# EAGLE design Uniformity Array (EAGLE 7.5.0)
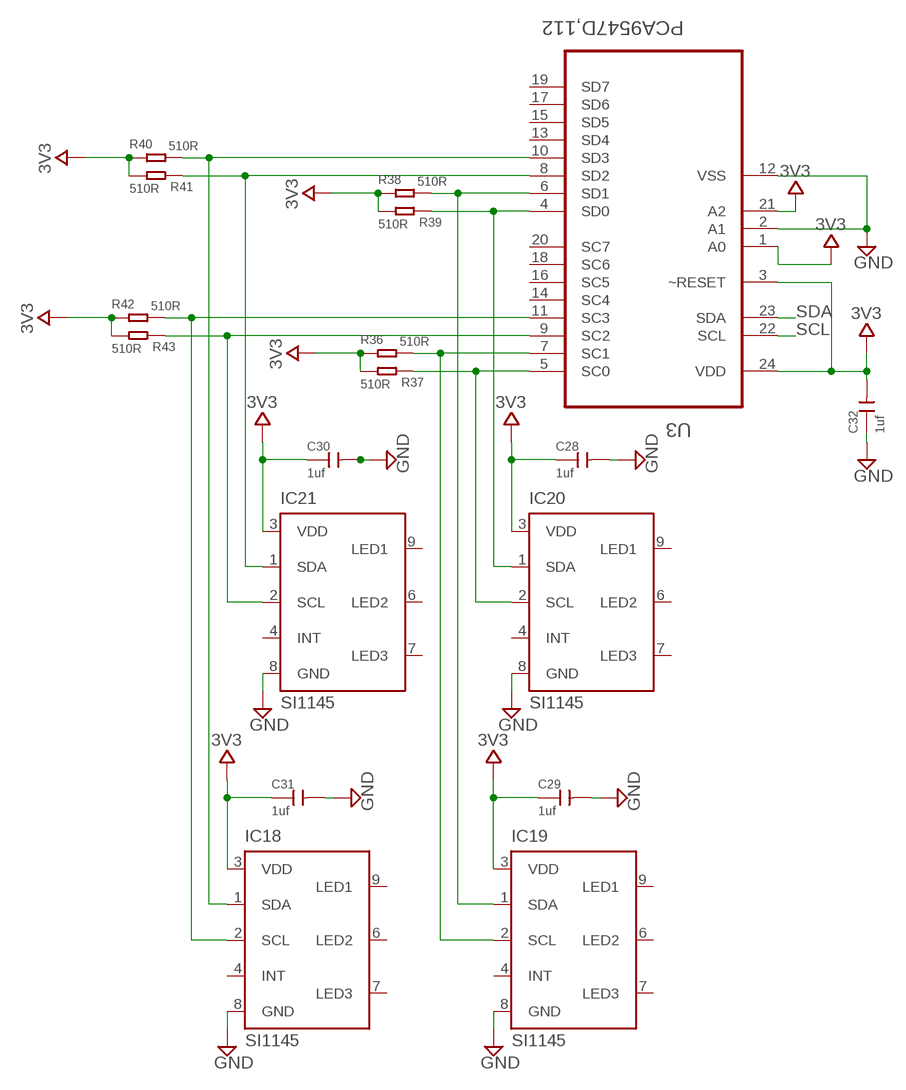
[diagram p0: schematic, sheet 1, part 1 of 2]
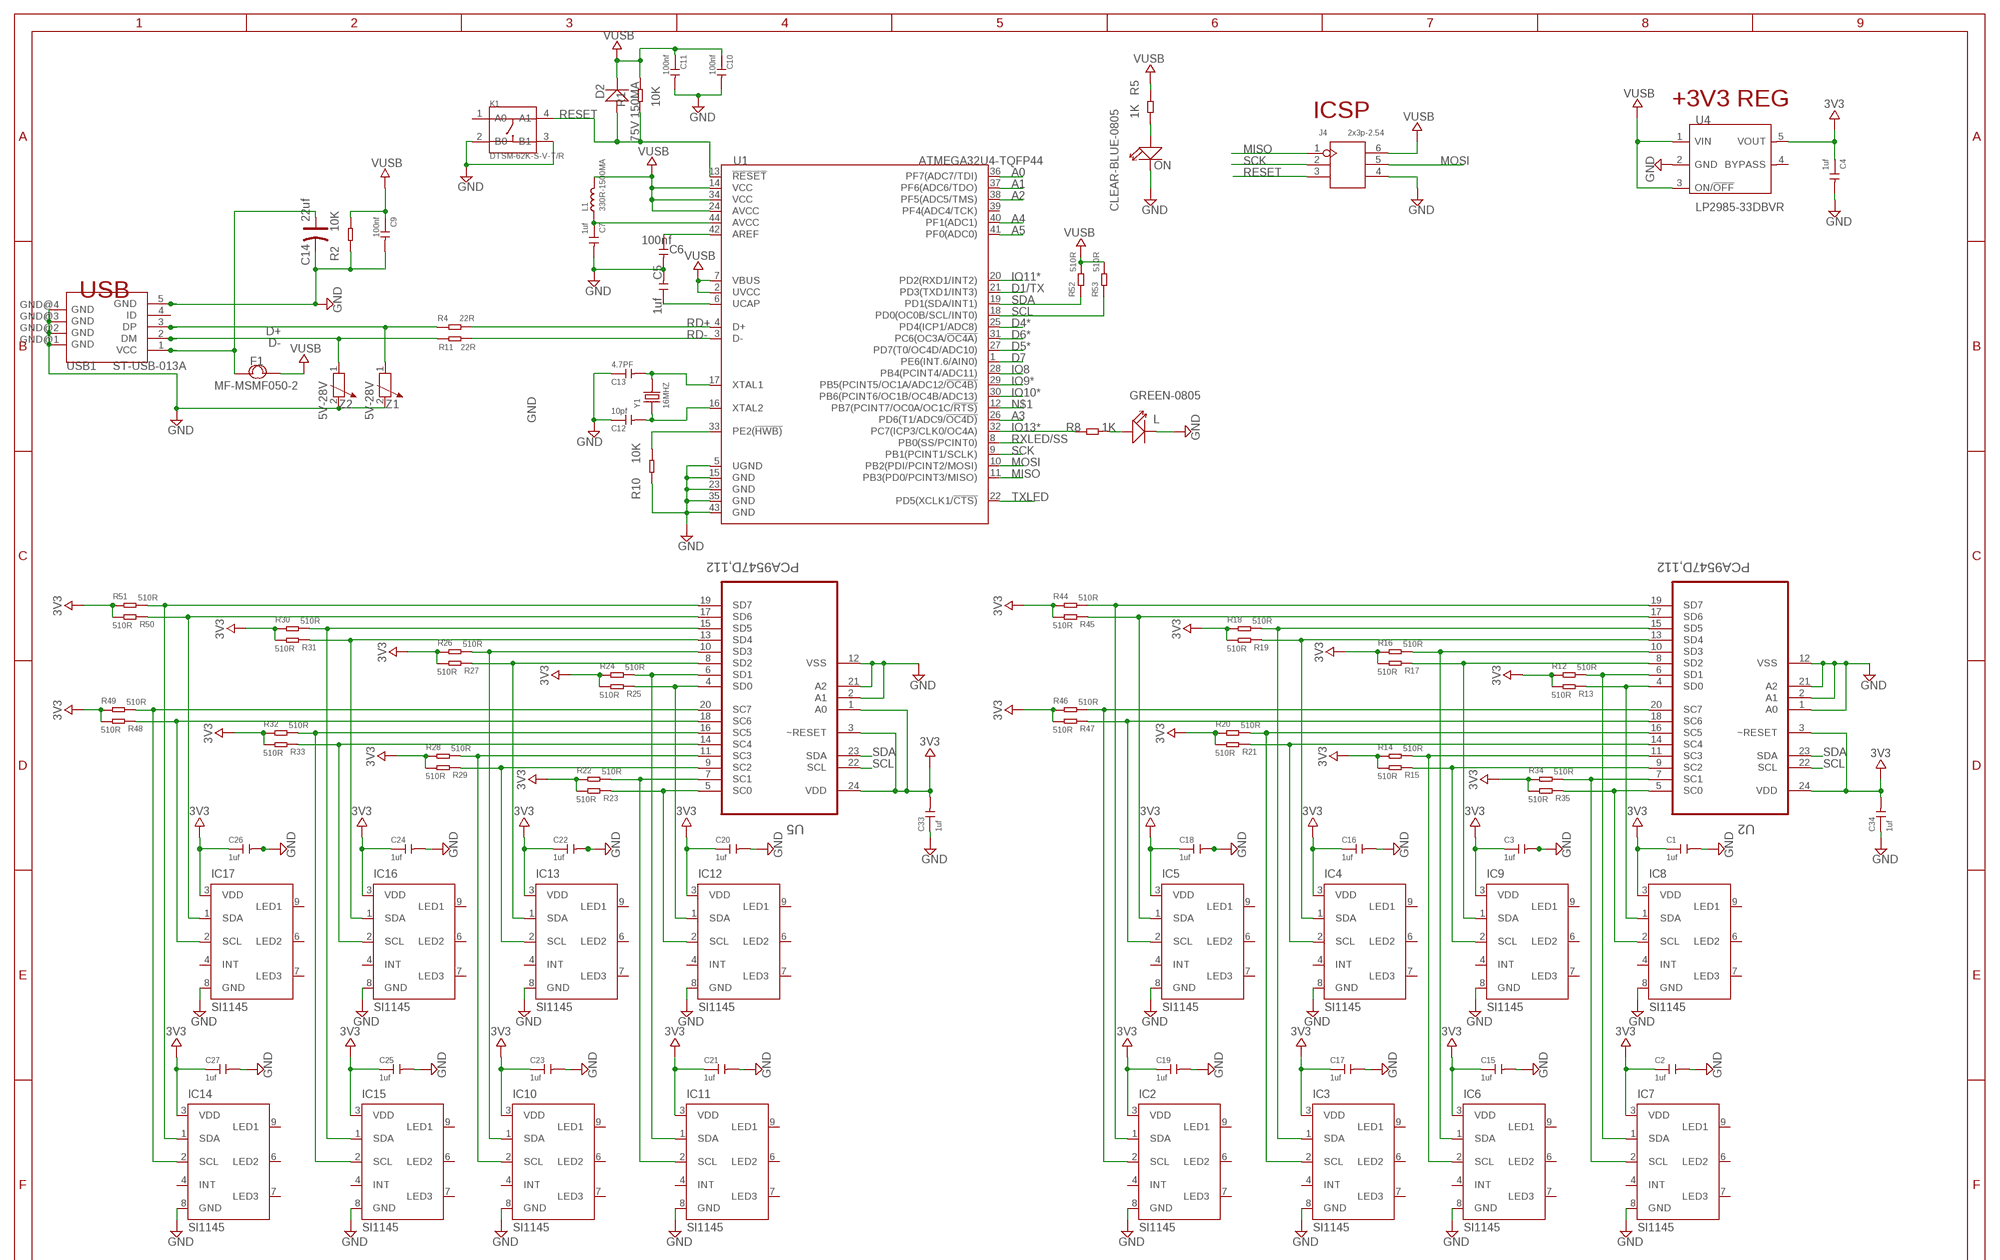
[diagram p1: schematic, sheet 1, part 2 of 2]

## Parts
C1  1uf  CERAMIC-1UF-10V-10%-X5R(0402)  [C0402]
C2  1uf  CERAMIC-1UF-10V-10%-X5R(0402)  [C0402]
C3  1uf  CERAMIC-1UF-10V-10%-X5R(0402)  [C0402]
C4  1uf  CERAMIC-1UF-10V-10%-X5R(0402)  [C0402]
C5  1uf  CERAMIC-1UF-10V-10%-X5R(0402)  [C0402]
C6  100nf  CERAMIC-100NF-25V-10%-X7R(0402)  [C0402]
C7  1uf  CERAMIC-1UF-10V-10%-X5R(0402)  [C0402]
C9  100nf  CERAMIC-100NF-25V-10%-X7R(0402)  [C0402]
C10  100nf  CERAMIC-100NF-25V-10%-X7R(0402)  [C0402]
C11  100nf  CERAMIC-100NF-25V-10%-X7R(0402)  [C0402]
C12  10pf  CERAMIC-10PF-50V-5%-NPO(0603)  [C0603]
C13  4.7PF  CERAMIC-4.7PF-50V-0.25PF-NPO(0603)  [C0603]
C14  22uf  TANTALUM-SMD-22UF-10V(AVX-A)  [AVX-A]
C15  1uf  CERAMIC-1UF-10V-10%-X5R(0402)  [C0402]
C16  1uf  CERAMIC-1UF-10V-10%-X5R(0402)  [C0402]
C17  1uf  CERAMIC-1UF-10V-10%-X5R(0402)  [C0402]
C18  1uf  CERAMIC-1UF-10V-10%-X5R(0402)  [C0402]
C19  1uf  CERAMIC-1UF-10V-10%-X5R(0402)  [C0402]
C20  1uf  CERAMIC-1UF-10V-10%-X5R(0402)  [C0402]
C21  1uf  CERAMIC-1UF-10V-10%-X5R(0402)  [C0402]
C22  1uf  CERAMIC-1UF-10V-10%-X5R(0402)  [C0402]
C23  1uf  CERAMIC-1UF-10V-10%-X5R(0402)  [C0402]
C24  1uf  CERAMIC-1UF-10V-10%-X5R(0402)  [C0402]
C25  1uf  CERAMIC-1UF-10V-10%-X5R(0402)  [C0402]
C26  1uf  CERAMIC-1UF-10V-10%-X5R(0402)  [C0402]
C27  1uf  CERAMIC-1UF-10V-10%-X5R(0402)  [C0402]
C28  1uf  CERAMIC-1UF-10V-10%-X5R(0402)  [C0402]
C29  1uf  CERAMIC-1UF-10V-10%-X5R(0402)  [C0402]
C30  1uf  CERAMIC-1UF-10V-10%-X5R(0402)  [C0402]
C31  1uf  CERAMIC-1UF-10V-10%-X5R(0402)  [C0402]
C32  1uf  CERAMIC-1UF-10V-10%-X5R(0402)  [C0402]
C33  1uf  CERAMIC-1UF-10V-10%-X5R(0402)  [C0402]
C34  1uf  CERAMIC-1UF-10V-10%-X5R(0402)  [C0402]
D2  75V 150MA  SMD-DIODE-SWITCHING-75V-150MA(D1206)  [LED-1206]
F1  MF-MSMF050-2  SMD-PPTC-USE-PPTC-0.50A-15V-0.15OHM(1812)  [F1812]
IC2  SI1145  [QFN-10]
IC3  SI1145  [QFN-10]
IC4  SI1145  [QFN-10]
IC5  SI1145  [QFN-10]
IC6  SI1145  [QFN-10]
IC7  SI1145  [QFN-10]
IC8  SI1145  [QFN-10]
IC9  SI1145  [QFN-10]
IC10  SI1145  [QFN-10]
IC11  SI1145  [QFN-10]
IC12  SI1145  [QFN-10]
IC13  SI1145  [QFN-10]
IC14  SI1145  [QFN-10]
IC15  SI1145  [QFN-10]
IC16  SI1145  [QFN-10]
IC17  SI1145  [QFN-10]
IC18  SI1145  [QFN-10]
IC19  SI1145  [QFN-10]
IC20  SI1145  [QFN-10]
IC21  SI1145  [QFN-10]
J4  2x3p-2.54  DIP-BLACK-MALE-HEADER(2X3P-2.54）-2.54  [H2X3-2.54]
K1  DTSM-62K-S-V-T/R  SMD-SWITCH-TACTILE-SPST-NO(4P-D6.0MM)  [SW4-SMD-6.0X6.0X5.0MM]
L  GREEN-0805  SMD-LED-CLEAR-GREEN(0805)  [LED-0805]
L1  330R-1500MA  SMD-FERRITE-BEAD-330R-1500MA(0805)'0805'  [L0805]
ON  CLEAR-BLUE-0805  SMD-LED-CLEAR-BLUE(0805)  [LED-0805]
R1  10K  SMD-RES-10K-5%-1/(0402)  [R0402]
R2  10K  SMD-RES-10K-5%-1/(0402)  [R0402]
R4  22R  SMD-RES-22R-5%-1/10W(0603)  [R0603]
R5  1K  SMD-RES-1K-5%-1/16W(0402)  [R0402]
R8  1K  SMD-RES-1K-5%-1/16W(0402)  [R0402]
R10  10K  SMD-RES-10K-5%-1/(0402)  [R0402]
R11  22R  SMD-RES-22R-5%-1/10W(0603)  [R0603]
R12  510R  SMD-RES-510R-5%-1/10W(0603)  [R0603]
R13  510R  SMD-RES-510R-5%-1/10W(0603)  [R0603]
R14  510R  SMD-RES-510R-5%-1/10W(0603)  [R0603]
R15  510R  SMD-RES-510R-5%-1/10W(0603)  [R0603]
R16  510R  SMD-RES-510R-5%-1/10W(0603)  [R0603]
R17  510R  SMD-RES-510R-5%-1/10W(0603)  [R0603]
R18  510R  SMD-RES-510R-5%-1/10W(0603)  [R0603]
R19  510R  SMD-RES-510R-5%-1/10W(0603)  [R0603]
R20  510R  SMD-RES-510R-5%-1/10W(0603)  [R0603]
R21  510R  SMD-RES-510R-5%-1/10W(0603)  [R0603]
R22  510R  SMD-RES-510R-5%-1/10W(0603)  [R0603]
R23  510R  SMD-RES-510R-5%-1/10W(0603)  [R0603]
R24  510R  SMD-RES-510R-5%-1/10W(0603)  [R0603]
R25  510R  SMD-RES-510R-5%-1/10W(0603)  [R0603]
R26  510R  SMD-RES-510R-5%-1/10W(0603)  [R0603]
R27  510R  SMD-RES-510R-5%-1/10W(0603)  [R0603]
R28  510R  SMD-RES-510R-5%-1/10W(0603)  [R0603]
R29  510R  SMD-RES-510R-5%-1/10W(0603)  [R0603]
R30  510R  SMD-RES-510R-5%-1/10W(0603)  [R0603]
R31  510R  SMD-RES-510R-5%-1/10W(0603)  [R0603]
R32  510R  SMD-RES-510R-5%-1/10W(0603)  [R0603]
R33  510R  SMD-RES-510R-5%-1/10W(0603)  [R0603]
R34  510R  SMD-RES-510R-5%-1/10W(0603)  [R0603]
R35  510R  SMD-RES-510R-5%-1/10W(0603)  [R0603]
R36  510R  SMD-RES-510R-5%-1/10W(0603)  [R0603]
R37  510R  SMD-RES-510R-5%-1/10W(0603)  [R0603]
R38  510R  SMD-RES-510R-5%-1/10W(0603)  [R0603]
R39  510R  SMD-RES-510R-5%-1/10W(0603)  [R0603]
R40  510R  SMD-RES-510R-5%-1/10W(0603)  [R0603]
R41  510R  SMD-RES-510R-5%-1/10W(0603)  [R0603]
R42  510R  SMD-RES-510R-5%-1/10W(0603)  [R0603]
R43  510R  SMD-RES-510R-5%-1/10W(0603)  [R0603]
R44  510R  SMD-RES-510R-5%-1/10W(0603)  [R0603]
R45  510R  SMD-RES-510R-5%-1/10W(0603)  [R0603]
R46  510R  SMD-RES-510R-5%-1/10W(0603)  [R0603]
R47  510R  SMD-RES-510R-5%-1/10W(0603)  [R0603]
R48  510R  SMD-RES-510R-5%-1/10W(0603)  [R0603]
R49  510R  SMD-RES-510R-5%-1/10W(0603)  [R0603]
R50  510R  SMD-RES-510R-5%-1/10W(0603)  [R0603]
R51  510R  SMD-RES-510R-5%-1/10W(0603)  [R0603]
R52  510R  SMD-RES-510R-5%-1/10W(0603)  [R0603]
R53  510R  SMD-RES-510R-5%-1/10W(0603)  [R0603]
U1  ATMEGA32U4-TQFP44  MCU-ATMEGA32U4(TQFP44)-AU  [TQFP44-0.8-9.6X9.6MM]
U2  PCA9547D,112  [SOIC127P1032X265-24N]
U3  PCA9547D,112  [SOIC127P1032X265-24N]
U4  LP2985-33DBVR  PMIC-LP2985-33DBVR(SOT23-5)  [SOT-23-5]
U5  PCA9547D,112  [SOIC127P1032X265-24N]
USB1  ST-USB-013A  MINI-USB2.0-RECEPT-5POS-4-LEGS-(ST-USB-013A)  [MINIUSB5+4P-0.8-90D]
Y1  16MHZ  SMD-CRYSTAL-16MHZ-8PF-20PPM-40R(2P-5.0X3.2MM)  [X2-SMD-5.0X3.2X1.3MM]
Z1  5V-28V  SMD-RES-VARISTOR-5V-28V(0603)  [R0603]
Z2  5V-28V  SMD-RES-VARISTOR-5V-28V(0603)  [R0603]

## Nets
3V3: C1.1 C2.1 C3.1 C4.1 C15.1 C16.1 C17.1 C18.1 C19.1 C20.1 C21.1 C22.1 C23.1 C24.1 C25.1 C26.1 C27.1 C28.1 C29.1 C30.1 C31.1 C32.2 C33.2 C34.2 IC2.3(VDD) IC3.3(VDD) IC4.3(VDD) IC5.3(VDD) IC6.3(VDD) IC7.3(VDD) IC8.3(VDD) IC9.3(VDD) IC10.3(VDD) IC11.3(VDD) IC12.3(VDD) IC13.3(VDD) IC14.3(VDD) IC15.3(VDD) IC16.3(VDD) IC17.3(VDD) IC18.3(VDD) IC19.3(VDD) IC20.3(VDD) IC21.3(VDD) R12.1 R13.1 R14.1 R15.1 R16.1 R17.1 R18.1 R19.1 R20.1 R21.1 R22.1 R23.1 R24.1 R25.1 R26.1 R27.1 R28.1 R29.1 R30.1 R31.1 R32.1 R33.1 R34.1 R35.1 R36.1 R37.1 R38.1 R39.1 R40.1 R41.1 R42.1 R43.1 R44.1 R45.1 R46.1 R47.1 R48.1 R49.1 R50.1 R51.1 U2.3(~RESET) U2.24(VDD) U3.1(A0) U3.3(~RESET) U3.21(A2) U3.24(VDD) U4.5(VOUT) U5.1(A0) U5.3(~RESET) U5.24(VDD)
A0: U1.36(PF7(ADC7/TDI))
A1: U1.37(PF6(ADC6/TDO))
A2: U1.38(PF5(ADC5/TMS))
A3: U1.26(PD6(T1/ADC9/!OC4D))
A4: U1.40(PF1(ADC1))
A5: U1.41(PF0(ADC0))
AREF: C6.1 U1.42(AREF)
AVCC: C7.1 L1.1 U1.44(AVCC)
D1/TX: U1.21(PD3(TXD1/INT3))
D4*: U1.25(PD4(ICP1/ADC8))
D5*: U1.31(PC6(OC3A/!OC4A))
D6*: U1.27(PD7(T0/OC4D/ADC10))
D7: U1.1(PE6(INT.6/AIN0))
D+: R4.1 USB1.3(DP) Z1.1
D-: R11.1 USB1.2(DM) Z2.1
GND: C1.2 C2.2 C3.2 C4.2 C5.2 C6.2 C7.2 C9.2 C10.2 C11.2 C12.1 C13.1 C14.- C15.2 C16.2 C17.2 C18.2 C19.2 C20.2 C21.2 C22.2 C23.2 C24.2 C25.2 C26.2 C27.2 C28.2 C29.2 C30.2 C31.2 C32.1 C33.1 C34.1 IC2.8(GND) IC3.8(GND) IC4.8(GND) IC5.8(GND) IC6.8(GND) IC7.8(GND) IC8.8(GND) IC9.8(GND) IC10.8(GND) IC11.8(GND) IC12.8(GND) IC13.8(GND) IC14.8(GND) IC15.8(GND) IC16.8(GND) IC17.8(GND) IC18.8(GND) IC19.8(GND) IC20.8(GND) IC21.8(GND) J4.4 K1.2(B0) K1.3(B1) L.- ON.- R2.1 R10.1 U1.5(UGND) U1.15(GND) U1.23(GND) U1.35(GND) U1.43(GND) U2.1(A0) U2.2(A1) U2.12(VSS) U2.21(A2) U3.2(A1) U3.12(VSS) U4.2(GND) U5.2(A1) U5.12(VSS) U5.21(A2) USB1.5(GND) USB1.GND@1(GND) USB1.GND@2(GND) USB1.GND@3(GND) USB1.GND@4(GND) Z1.2 Z2.2
IO8: U1.28(PB4(PCINT4/ADC11))
IO9*: U1.29(PB5(PCINT5/OC1A/ADC12/!OC4B))
IO10*: U1.30(PB6(PCINT6/OC1B/OC4B/ADC13))
IO11*: U1.20(PD2(RXD1/INT2))
IO13*: R8.1 U1.32(PC7(ICP3/CLK0/OC4A))
MISO: J4.1 U1.11(PB3(PD0/PCINT3/MISO))
MOSI: J4.5 U1.10(PB2(PDI/PCINT2/MOSI))
N$1: U1.12(PB7(PCINT7/OC0A/OC1C/!RTS))
N$2: IC5.2(SCL) R47.2 U2.18(SC6)
N$3: ON.+ R5.2
N$5: IC5.1(SDA) R45.2 U2.17(SD6)
N$6: R10.2 U1.33(PE2(!HWB))
N$7: L.+ R8.2
N$8: IC7.1(SDA) R12.2 U2.6(SD1)
N$9: IC7.2(SCL) R34.2 U2.7(SC1)
N$10: IC8.1(SDA) R13.2 U2.4(SD0)
N$11: IC8.2(SCL) R35.2 U2.5(SC0)
N$12: IC3.1(SDA) R18.2 U2.15(SD5)
N$13: IC4.1(SDA) R19.2 U2.13(SD4)
N$14: IC4.2(SCL) R21.2 U2.14(SC4)
N$15: IC3.2(SCL) R20.2 U2.16(SC5)
N$16: IC9.1(SDA) R17.2 U2.8(SD2)
N$17: IC9.2(SCL) R15.2 U2.9(SC2)
N$18: IC6.1(SDA) R16.2 U2.10(SD3)
N$19: IC6.2(SCL) R14.2 U2.11(SC3)
N$20: IC2.1(SDA) R44.2 U2.19(SD7)
N$21: IC2.2(SCL) R46.2 U2.20(SC7)
N$24: IC11.1(SDA) R24.2 U5.6(SD1)
N$25: IC12.1(SDA) R25.2 U5.4(SD0)
N$26: IC12.2(SCL) R23.2 U5.5(SC0)
N$27: IC11.2(SCL) R22.2 U5.7(SC1)
N$28: IC13.1(SDA) R27.2 U5.8(SD2)
N$29: IC13.2(SCL) R29.2 U5.9(SC2)
N$30: IC10.1(SDA) R26.2 U5.10(SD3)
N$31: IC10.2(SCL) R28.2 U5.11(SC3)
N$32: IC15.1(SDA) R30.2 U5.15(SD5)
N$33: IC16.1(SDA) R31.2 U5.13(SD4)
N$34: IC16.2(SCL) R33.2 U5.14(SC4)
N$35: IC15.2(SCL) R32.2 U5.16(SC5)
N$36: IC17.1(SDA) R50.2 U5.17(SD6)
N$37: IC17.2(SCL) R48.2 U5.18(SC6)
N$38: IC14.1(SDA) R51.2 U5.19(SD7)
N$39: IC14.2(SCL) R49.2 U5.20(SC7)
N$40: IC19.1(SDA) R38.2 U3.6(SD1)
N$41: IC20.1(SDA) R39.2 U3.4(SD0)
N$42: IC20.2(SCL) R37.2 U3.5(SC0)
N$43: IC19.2(SCL) R36.2 U3.7(SC1)
N$44: IC21.1(SDA) R41.2 U3.8(SD2)
N$45: IC21.2(SCL) R43.2 U3.9(SC2)
N$46: IC18.1(SDA) R40.2 U3.10(SD3)
N$47: IC18.2(SCL) R42.2 U3.11(SC3)
RD+: R4.2 U1.4(D+)
RD-: R11.2 U1.3(D-)
RESET: D2.+ J4.3 K1.4(A1) R1.2 U1.13(!RESET)
RXLED/SS: U1.8(PB0(SS/PCINT0))
SCK: J4.2 U1.9(PB1(PCINT1/SCLK))
SCL: R53.1 U1.18(PD0(OC0B/SCL/INT0)) U2.22(SCL) U3.22(SCL) U5.22(SCL)
SDA: R52.1 U1.19(PD1(SDA/INT1)) U2.23(SDA) U3.23(SDA) U5.23(SDA)
TXLED: U1.22(PD5(XCLK1/!CTS))
UCAP: C5.1 U1.6(UCAP)
VUSB: C9.1 C10.1 C11.1 D2.- F1.2 J4.6 L1.2 R1.1 R2.2 R5.1 R52.2 R53.2 U1.2(UVCC) U1.7(VBUS) U1.14(VCC) U1.24(AVCC) U1.34(VCC) U4.1(VIN) U4.3(ON/!OFF)
VUSBD: C14.+ F1.1 USB1.1(VCC)
XTAL1: C13.2 U1.17(XTAL1) Y1.2
XTAL2: C12.2 U1.16(XTAL2) Y1.1
Unconnected: IC2.4(INT) IC2.6(LED2) IC2.7(LED3) IC2.9(LED1) IC3.4(INT) IC3.6(LED2) IC3.7(LED3) IC3.9(LED1) IC4.4(INT) IC4.6(LED2) IC4.7(LED3) IC4.9(LED1) IC5.4(INT) IC5.6(LED2) IC5.7(LED3) IC5.9(LED1) IC6.4(INT) IC6.6(LED2) IC6.7(LED3) IC6.9(LED1) IC7.4(INT) IC7.6(LED2) IC7.7(LED3) IC7.9(LED1) IC8.4(INT) IC8.6(LED2) IC8.7(LED3) IC8.9(LED1) IC9.4(INT) IC9.6(LED2) IC9.7(LED3) IC9.9(LED1) IC10.4(INT) IC10.6(LED2) IC10.7(LED3) IC10.9(LED1) IC11.4(INT) IC11.6(LED2) IC11.7(LED3) IC11.9(LED1) IC12.4(INT) IC12.6(LED2) IC12.7(LED3) IC12.9(LED1) IC13.4(INT) IC13.6(LED2) IC13.7(LED3) IC13.9(LED1) IC14.4(INT) IC14.6(LED2) IC14.7(LED3) IC14.9(LED1) IC15.4(INT) IC15.6(LED2) IC15.7(LED3) IC15.9(LED1) IC16.4(INT) IC16.6(LED2) IC16.7(LED3) IC16.9(LED1) IC17.4(INT) IC17.6(LED2) IC17.7(LED3) IC17.9(LED1) IC18.4(INT) IC18.6(LED2) IC18.7(LED3) IC18.9(LED1) IC19.4(INT) IC19.6(LED2) IC19.7(LED3) IC19.9(LED1) IC20.4(INT) IC20.6(LED2) IC20.7(LED3) IC20.9(LED1) IC21.4(INT) IC21.6(LED2) IC21.7(LED3) IC21.9(LED1) K1.1(A0) U1.39(PF4(ADC4/TCK)) U3.13(SD4) U3.14(SC4) U3.15(SD5) U3.16(SC5) U3.17(SD6) U3.18(SC6) U3.19(SD7) U3.20(SC7) U4.4(BYPASS) USB1.4(ID)

## Notes on the sheet
- +3V3 REG
- ICSP
- USB

## Library data of the parts
C1-C5 C7 C15-C34 = Seeed-Capacitor-2016:CERAMIC-1UF-10V-10%-X5R(0402): 302010040; MPN: CC0402KRX5R6BB105
C6 C9-C11 = Seeed-Capacitor-2016:CERAMIC-100NF-25V-10%-X7R(0402): 302010024; MPN: CC0402KRX7R8BB104
C12 = Seeed-Capacitor-2016:CERAMIC-10PF-50V-5%-NPO(0603): 302010097; MPN: CC0603JRNPO9BN100
C13 = Seeed-Capacitor-2016:CERAMIC-4.7PF-50V-0.25PF-NPO(0603): 302010091; MPN: CC0603CRNPO9BN4R7
C14 = Seeed-Capacitor-2016:TANTALUM-SMD-22UF-10V(AVX-A): 302020008; MPN: TAJA226*010#NJ
D2 = Seeed-Diode-2016:SMD-DIODE-SWITCHING-75V-150MA(D1206): 304040005; MPN: CD1206-S01575
F1 = Seeed-Fuse-2016:SMD-PPTC-USE-PPTC-0.50A-15V-0.15OHM(1812): 307010040; MPN: MF-MSMF050-2
IC2-IC21 = silabs:SI114*: PROXIMITY/UV/AMBIENT LIGHT SENSOR IC WITH I2C INTERFACE Source: http://www.silabs.com/Support%20Documents/TechnicalDocs/Si1145-46-47.pdf
J4 = Seeed-Connector -2016:DIP-BLACK-MALE-HEADER(2X3P-2.54）: 320020077; MPN: P125-12A1BS116A1
K1 = Seeed-Switch-2016:SMD-SWITCH-TACTILE-SPST-NO(4P-D6.0MM): 311020004; MPN: DTSM-62K-S-V-T/R(SN431)
L = Seeed-LED-2016:SMD-LED-CLEAR-GREEN(0805): 304090057; MPN: 17-215SYGC/S530-E2/TR8
L1 = Seeed-OPL-Inductor:SMD-FERRITE-BEAD-330R-1500MA(0805): 303030006; MPN: BLM21PG331SN1D
ON = Seeed-LED-2016:SMD-LED-CLEAR-BLUE(0805): 304090061; MPN: EL-17-215/BHC-AN1P2/3T
R1 R2 = Seeed-Resistor-2016:SMD-RES-10K-5%-1/(0402): 301010004; MPN: RC0402JR-0710KL
R4 R11 = Seeed-Resistor-2016:SMD-RES-22R-5%-1/10W(0603): 301010289; MPN: RC0603JR-0722RL
R5 R8 = Seeed-Resistor-2016:SMD-RES-1K-5%-1/16W(0402): 301010006; MPN: RC0402JR-071KL
R10 = Seeed-OPL-Resistor:SMD-RES-10K-5%-1/(0402): 301010004; MPN: RC0402JR-0710KL
R12-R53 = Seeed-Resistor-2016:SMD-RES-510R-5%-1/10W(0603): 301010157; MPN: RC0603JR-07510RL
U1 = Seeed-OPL-ic:MCU-ATMEGA32U4(TQFP44): 310010010; MPN: ATMEGA32U4
U2 U3 U5 = NXP_By_element14_Batch_1:PCA9547D,112: 8-channel I2C-bus multiplexer with reset; MPN: PCA9547D,112; OC_FARNELL: -; OC_NEWARK: 70R6613; PACKAGE: SOIC-24; SUPPLIER: NXP
U4 = Seeed-IC-2016:PMIC-LP2985-33DBVR(SOT23-5): 310030033; MPN: LP2985-33DBVR
USB1 = Seeed-Connector -2016:MINI-USB2.0-RECEPT-5POS-4-LEGS-(ST-USB-013A): 320010014; MPN: ST-USB-013A
Y1 = Seeed-Crystal Oscillator-2016:SMD-CRYSTAL-16MHZ-8PF-20PPM-40R(2P-5.0X3.2MM): 306010054; MPN: X053201602002
Z1 Z2 = Seeed-Diode-2016:SMD-RES-VARISTOR-5V-28V(0603): 314130003; MPN: CG0603MLC-05E

## Net classes
0 default: width 0.254 mm, drill 0.61 mm, clearance 0.203 mm

## Board
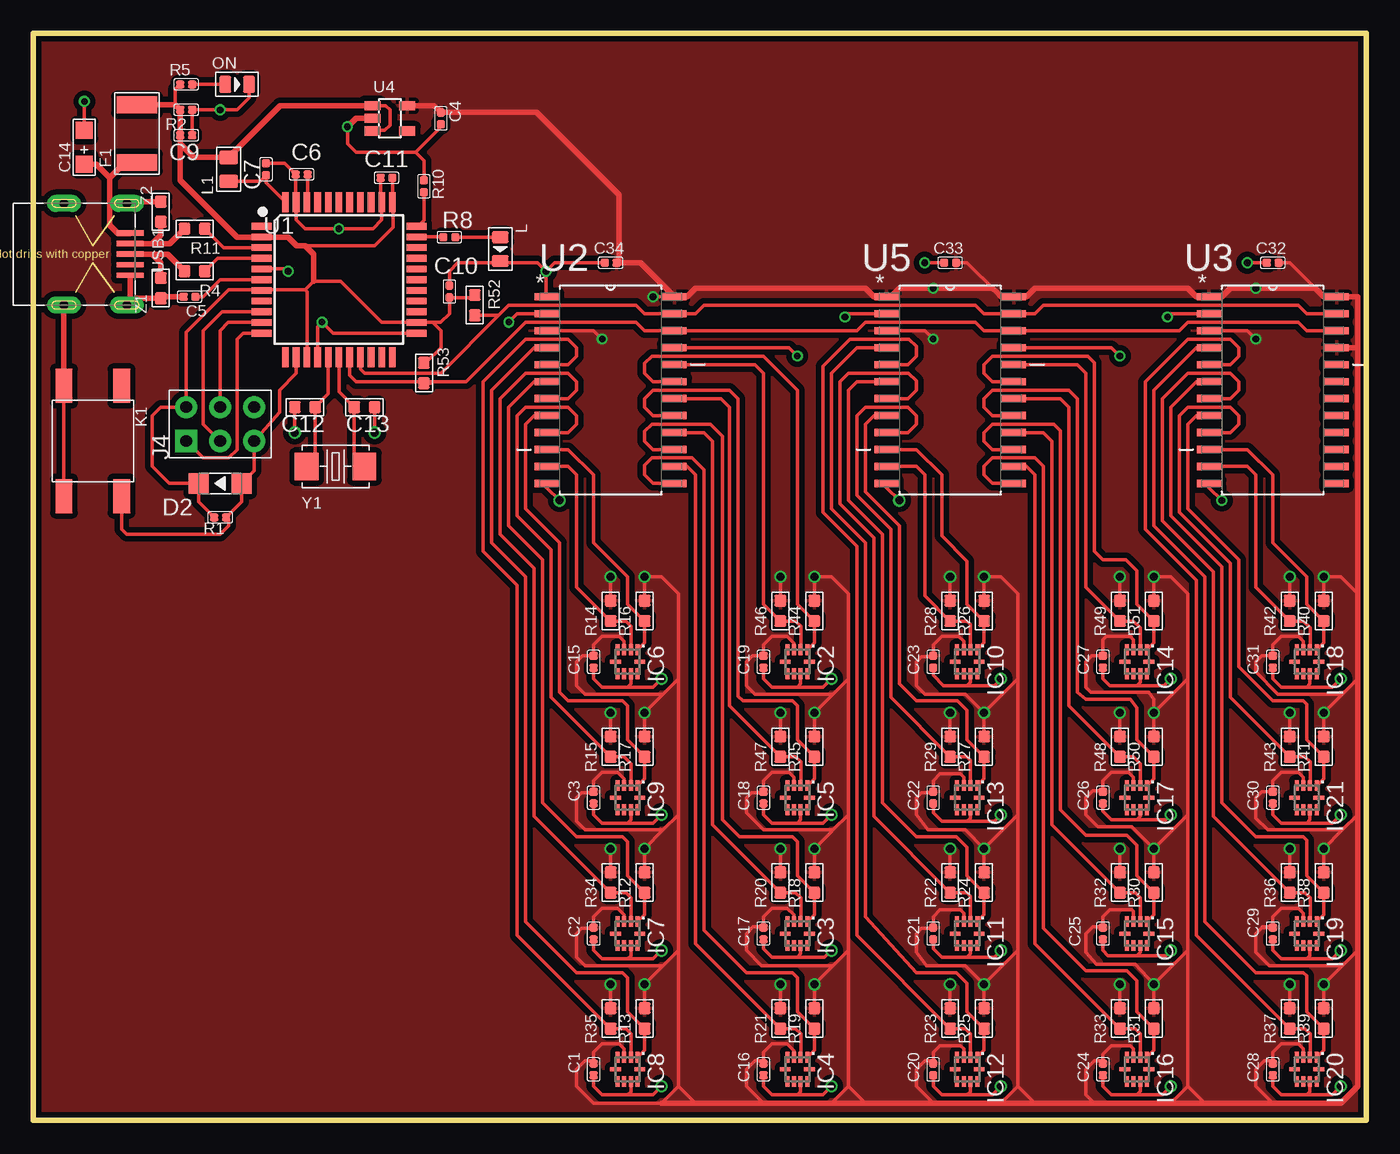
[diagram p2: board, top side]
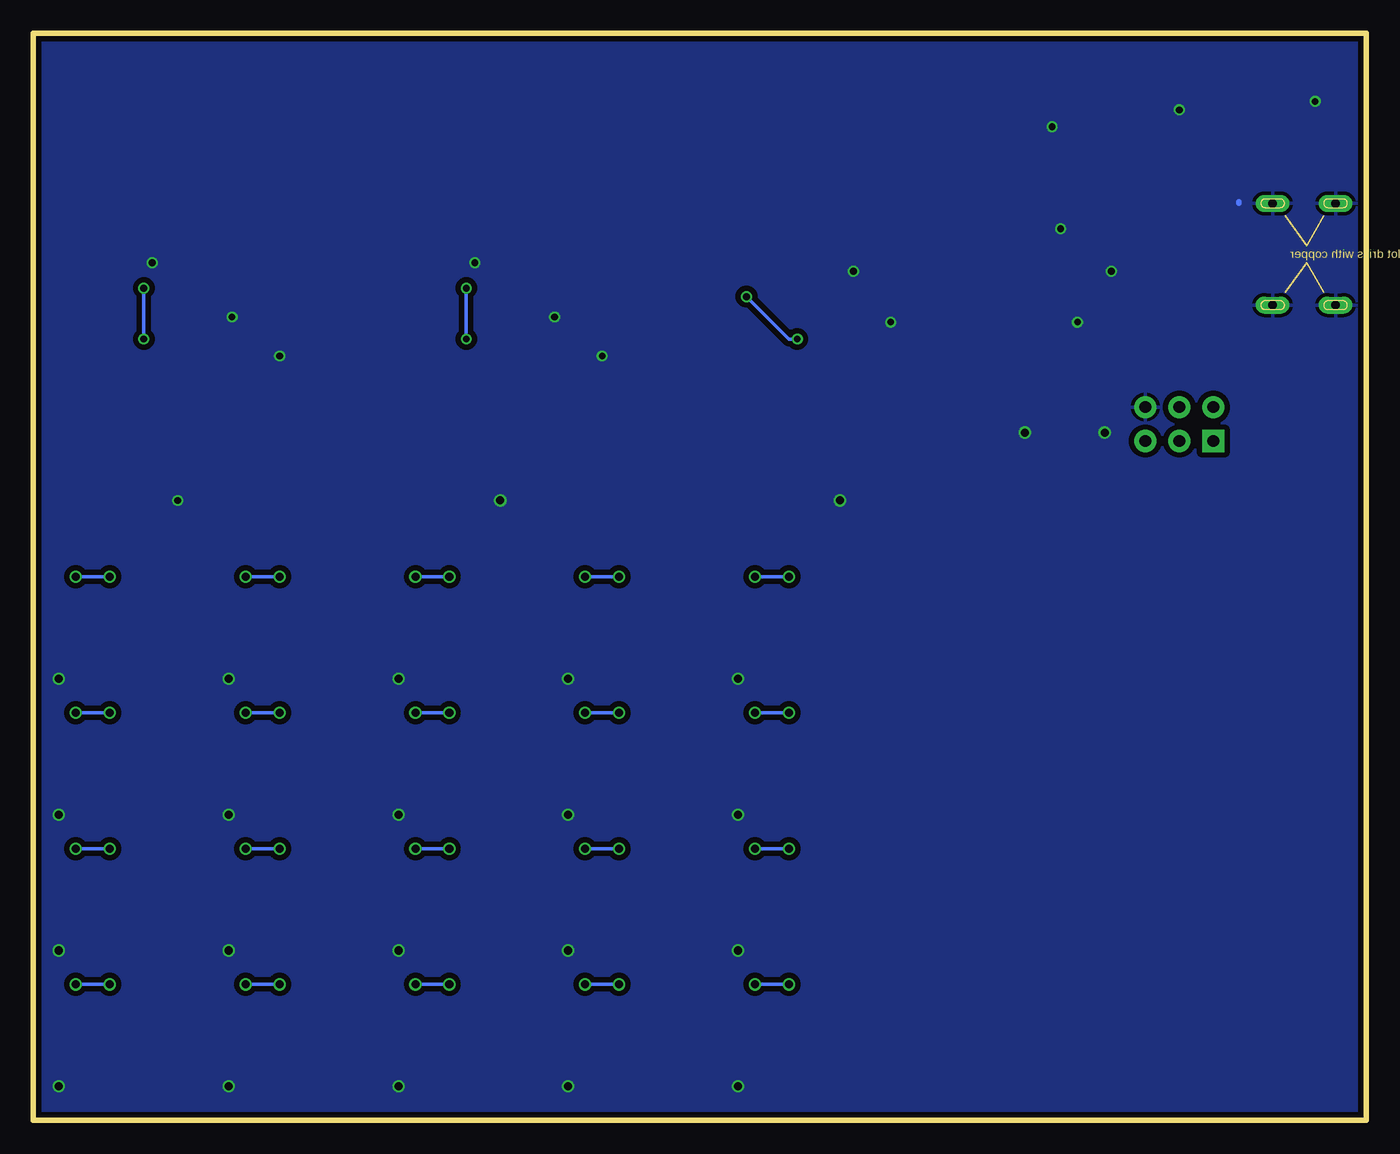
[diagram p3: board, bottom side, seen from below]

Size 99.69 x 81.28 mm. Coordinates in mm from the lower left corner, seen from the top.
Outline: 0,0 99.69,0 99.69,81.28 0,81.28 0,0
Copper layers (1*16): Top 0.035mm / dielectric 1.5mm / Bottom 0.035mm
Design rules "SeeedStudio_2layer_DRU_no_angle_20140221": minimum track width 6mil, minimum drill 12mil, track to track 6mil, track to pad 6mil, pad to pad 6mil, via to via 6mil, smd to smd 0mil, copper to edge 10mil, drill to drill 10mil, minimum pad ring 10mil, minimum via ring 6mil, stop-mask expansion 2mil, vias tented up to drill 100mil, thermal gap 10mil

### Footprints (pad centres in the part's own frame; a part is rotated, then mirrored left to right if it is on the bottom)
C0402 = smd 0.635 x 0.635: 1 0,0.445; 2 0,-0.445
C0603 = smd 0.889 x 0.889: 1 0,0.762; 2 0,-0.762
AVX-A = smd 1.27 x 1.27: + -1.27,0; - 1.27,0
LED-1206 = smd 1.5 x 1.5: + -1.6,0; - 1.6,0
F1812 = smd 1.27 x 3.048: 1 -2.159,0; 2 2.159,0
QFN-10 = smd 0.8 x 0.3: 1 -0.9,0.75; 2 -0.9,0.25; 3 -0.9,-0.25; 4 -0.9,-0.75; 6 0.9,-0.75; 7 0.9,-0.25; 8 0.9,0.25; 9 0.9,0.75 | smd 0.3 x 0.8: 5 0,-0.9; 10 0,0.9
H2X3-2.54 = drill 0.889 pad 1.651 square: 1 -1.27,2.54 | drill 0.889 pad 1.651: 2 -1.27,0; 3 -1.27,-2.54; 4 1.27,-2.54; 5 1.27,0; 6 1.27,2.54
SW4-SMD-6.0X6.0X5.0MM = smd 2.54 x 1.27: 1 -4.129,2.159; 2 -4.129,-2.159; 3 4.129,-2.159; 4 4.129,2.159
LED-0805 = smd 0.889 x 1.27: + -0.889,0; - 0.889,0
L0805 = smd 1.016 x 1.397: 1 -0.889,0; 2 0.889,0
R0402 = smd 0.635 x 0.635: 1 0,0.445; 2 0,-0.445
R0603 = smd 0.889 x 0.889: 1 0,0.762; 2 0,-0.762
TQFP44-0.8-9.6X9.6MM = smd 1.5 x 0.5: 1 -5.8,4; 2 -5.8,3.2; 3 -5.8,2.4; 4 -5.8,1.6; 5 -5.8,0.8; 6 -5.8,0; 7 -5.8,-0.8; 8 -5.8,-1.6; 9 -5.8,-2.4; 10 -5.8,-3.2; 11 -5.8,-4; 23 5.8,-4; 24 5.8,-3.2; 25 5.8,-2.4; 26 5.8,-1.6; 27 5.8,-0.8; 28 5.8,0; 29 5.8,0.8; 30 5.8,1.6; 31 5.8,2.4; 32 5.8,3.2; 33 5.8,4 | smd 0.5 x 1.5: 12 -4,-5.8; 13 -3.2,-5.8; 14 -2.4,-5.8; 15 -1.6,-5.8; 16 -0.8,-5.8; 17 0,-5.8; 18 0.8,-5.8; 19 1.6,-5.8; 20 2.4,-5.8; 21 3.2,-5.8; 22 4,-5.8; 34 4,5.8; 35 3.2,5.8; 36 2.4,5.8; 37 1.6,5.8; 38 0.8,5.8; 39 0,5.8; 40 -0.8,5.8; 41 -1.6,5.8; 42 -2.4,5.8; 43 -3.2,5.8; 44 -4,5.8
SOIC127P1032X265-24N = smd 1.803 x 0.533: 1 -4.775,6.985; 2 -4.775,5.715; 3 -4.775,4.445; 4 -4.775,3.175; 5 -4.775,1.905; 6 -4.775,0.635; 7 -4.775,-0.635; 8 -4.775,-1.905; 9 -4.775,-3.175; 10 -4.775,-4.445; 11 -4.775,-5.715; 12 -4.775,-6.985; 13 4.775,-6.985; 14 4.775,-5.715; 15 4.775,-4.445; 16 4.775,-3.175; 17 4.775,-1.905; 18 4.775,-0.635; 19 4.775,0.635; 20 4.775,1.905; 21 4.775,3.175; 22 4.775,4.445; 23 4.775,5.715; 24 4.775,6.985
SOT-23-5 = smd 0.69 x 1.2: 1 -0.95,-1.3; 2 0,-1.3; 3 0.95,-1.3; 4 0.95,1.3; 5 -0.95,1.3
MINIUSB5+4P-0.8-90D = smd 2.032 x 0.406: 1 0.381,-1.575; 2 0.381,-0.787; 3 0.381,0; 4 0.381,0.787; 5 0.381,1.575 | drill 0.635 pad 1.27 long: GND@1 0.635,3.81; GND@2 5.334,3.81; GND@3 5.334,-3.81; GND@4 0.635,-3.81
X2-SMD-5.0X3.2X1.3MM = smd 1.778 x 2.032: 1 -2.159,0; 2 2.159,0

### Placement (x,y rotation side)
C1  41.91,3.81 0 top
C2  41.91,13.97 0 top
C3  41.91,24.13 0 top
C4  30.48,74.93 0 top
C5  11.68,61.59 270 top
C6  20.07,70.74 270 top
C7  17.4,71.12 180 top
C9  11.43,73.66 90 top
C10  31.11,61.98 180 top
C11  26.42,70.48 270 top
C12  20.32,53.34 90 top
C13  24.77,53.34 270 top
C14  3.81,72.77 90 top
C15  41.91,34.29 0 top
C16  54.61,3.81 0 top
C17  54.61,13.97 0 top
C18  54.61,24.13 0 top
C19  54.61,34.29 0 top
C20  67.31,3.81 0 top
C21  67.31,13.97 0 top
C22  67.31,24.13 0 top
C23  67.31,34.29 0 top
C24  80.01,3.81 0 top
C25  80.01,13.97 0 top
C26  80.01,24.13 0 top
C27  80.01,34.29 0 top
C28  92.71,3.81 0 top
C29  92.71,13.97 0 top
C30  92.71,24.13 0 top
C31  92.71,34.29 0 top
C32  92.71,64.14 90 top
C33  68.58,64.14 90 top
C34  43.18,64.14 90 top
D2  13.97,47.62 180 top
F1  7.75,73.79 90 top
IC2  57.15,34.29 270 top
IC3  57.15,13.97 270 top
IC4  57.15,3.81 270 top
IC5  57.15,24.13 270 top
IC6  44.45,34.29 270 top
IC7  44.45,13.97 270 top
IC8  44.45,3.81 270 top
IC9  44.45,24.13 270 top
IC10  69.85,34.29 270 top
IC11  69.85,13.97 270 top
IC12  69.85,3.81 270 top
IC13  69.85,24.13 270 top
IC14  82.55,34.29 270 top
IC15  82.55,13.97 270 top
IC16  82.55,3.81 270 top
IC17  82.55,24.13 270 top
IC18  95.25,34.29 270 top
IC19  95.25,13.97 270 top
IC20  95.25,3.81 270 top
IC21  95.25,24.13 270 top
J4  13.97,52.07 90 top
K1  4.45,50.8 270 top
L  34.92,65.15 270 top
L1  14.61,71.12 90 top
ON  15.24,77.47 0 top
R1  13.97,45.09 90 top
R2  11.43,75.56 270 top
R4  12.06,63.5 90 top
R5  11.43,77.47 90 top
R8  31.11,66.04 90 top
R10  29.21,69.85 0 top
R11  12.06,66.67 90 top
R12  45.72,17.78 0 top
R13  45.72,7.62 0 top
R14  43.18,38.1 0 top
R15  43.18,27.94 0 top
R16  45.72,38.1 0 top
R17  45.72,27.94 0 top
R18  58.42,17.78 0 top
R19  58.42,7.62 0 top
R20  55.88,17.78 0 top
R21  55.88,7.62 0 top
R22  68.58,17.78 0 top
R23  68.58,7.62 0 top
R24  71.12,17.78 0 top
R25  71.12,7.62 0 top
R26  71.12,38.1 0 top
R27  71.12,27.94 0 top
R28  68.58,38.1 0 top
R29  68.58,27.94 0 top
R30  83.82,17.78 0 top
R31  83.82,7.62 0 top
R32  81.28,17.78 0 top
R33  81.28,7.62 0 top
R34  43.18,17.78 0 top
R35  43.18,7.62 0 top
R36  93.98,17.78 0 top
R37  93.98,7.62 0 top
R38  96.52,17.78 0 top
R39  96.52,7.62 0 top
R40  96.52,38.1 0 top
R41  96.52,27.94 0 top
R42  93.98,38.1 0 top
R43  93.98,27.94 0 top
R44  58.42,38.1 0 top
R45  58.42,27.94 0 top
R46  55.88,38.1 0 top
R47  55.88,27.94 0 top
R48  81.28,27.94 0 top
R49  81.28,38.1 0 top
R50  83.82,27.94 0 top
R51  83.82,38.1 0 top
R52  33.02,60.96 180 top
R53  29.21,55.88 180 top
U1  22.86,62.87 0 top
U2  43.18,54.61 0 top
U3  92.71,54.61 0 top
U4  26.67,74.93 270 top
U5  68.58,54.61 0 top
USB1  7.62,64.77 180 top
Y1  22.61,48.9 0 top
Z1  9.53,62.23 0 top
Z2  9.53,67.94 180 top

### Tracks (layer width: path | path; a pad name or v marks a point on that pad's centre or on a via)
3V3  (via drill 0.5, 0.6)
  Top 0.254: IC14.3 82.3,35.94 82.04,36.2 80.26,36.2 80.01,35.94 C27.1 79.18,34.73 78.74,34.29 78.74,32.38 79.12,32 83.44,32 83.82,31.5 v83.82,30.48 | R49.1 v81.28,40.64 | R51.1 v83.82,40.64 85.09,40.64 86.36,39.37 86.36,33.02 | R48.1 v81.28,30.48 | v83.82,30.48 R50.1 | C26.1 80.01,24.64 | IC17.3 82.3,25.65 81.92,26.04 80.64,26.04 80.01,25.4 80.01,24.64 | R32.1 v81.28,20.32 | C25.1 80.01,14.48 | IC15.3 82.3,15.62 82.17,15.75 80.52,15.75 80.01,15.24 80.01,14.48 | R33.1 v81.28,10.16 | C24.1 80.01,4.45 | IC16.3 82.3,5.33 82.04,5.59 80.64,5.59 80.01,4.95 80.01,4.45 | IC10.3 69.6,35.81 69.22,36.2 67.94,36.2 67.31,35.56 C23.1 67.31,34.67 66.42,34.67 66.04,34.29 66.04,32.51 66.67,31.88 69.72,31.88 v71.12,30.48 | IC13.3 69.6,25.65 69.34,25.91 67.82,25.91 67.31,25.4 C22.1 67.31,24.51 66.42,24.51 66.04,24.13 66.04,22.86 66.93,21.72 69.72,21.72 v71.12,20.32 | IC11.3 69.6,15.49 69.34,15.75 67.82,15.75 67.31,15.24 C21.1 67.31,14.35 66.42,14.35 66.04,13.97 66.04,12.57 66.8,11.56 69.72,11.56 v71.12,10.16 | C20.1 67.31,4.45 | IC12.3 69.6,5.33 69.34,5.59 67.82,5.59 67.31,5.08 67.31,4.45 | R28.1 v68.58,40.64 | R26.1 v71.12,40.64 72.39,40.64 73.66,39.37 73.66,33.02 | R29.1 v68.58,30.48 | v71.12,30.48 R27.1 | R22.1 v68.58,20.32 | v71.12,20.32 R24.1 | R23.1 v68.58,10.16 | v71.12,10.16 R25.1 | 86.36,33.02 v83.82,30.48 | R30.1 v83.82,20.32 | 86.36,22.86 86.36,33.02 | R31.1 v83.82,10.16 | v83.82,10.16 86.36,12.7 | 80.01,24.64 79.25,24.64 78.74,24.13 78.74,22.86 79.63,21.97 82.17,21.97 v83.82,20.32 | 80.01,14.48 79.25,14.48 78.74,13.97 78.74,12.57 79.5,11.68 82.42,11.68 v83.82,10.16 | v71.12,30.48 73.66,33.02 | 73.66,33.02 73.66,22.86
  Top 0.254: 73.66,22.86 v71.12,20.32 | 73.66,22.86 73.66,12.7 | 73.66,12.7 v71.12,10.16 | IC2.3 56.9,35.69 56.39,36.2 55.24,36.2 54.61,35.56 C19.1 53.78,34.73 53.34,34.29 53.34,32.51 53.98,31.88 59.82,31.88 | IC5.3 56.9,25.65 56.52,26.04 55.24,26.04 54.61,25.4 C18.1 54.61,24.51 53.72,24.51 53.34,24.13 53.34,22.99 | C17.1 54.61,14.48 | IC3.3 56.9,15.37 56.39,15.88 55.24,15.88 54.61,15.24 54.61,14.48 | C16.1 54.61,4.45 | IC4.3 56.9,5.21 56.39,5.71 55.24,5.71 54.61,5.08 54.61,4.45 | R46.1 v55.88,40.64 | R44.1 v58.42,40.64 59.69,40.64 60.96,39.37 60.96,33.02 | R47.1 v55.88,30.48 | R45.1 v58.42,30.48 59.82,31.88 | R20.1 v55.88,20.32 | R18.1 v58.42,20.32 59.69,21.59 | R21.1 v55.88,10.16 | R19.1 v58.42,10.16 59.82,11.56 | 59.82,31.88 60.96,33.02 | 60.96,33.02 60.96,22.86 | 59.82,21.72 59.69,21.59 | 60.96,12.7 59.82,11.56 | 53.34,22.99 54.62,21.72 59.82,21.72 | 54.61,14.48 53.85,14.48 53.34,13.97 53.34,12.7 54.48,11.56 59.82,11.56 | IC6.3 44.2,35.81 43.81,36.2 42.55,36.2 41.91,35.56 C15.1 41.08,34.73 40.64,34.29 40.64,32.51 41.27,31.88 47.12,31.88 | IC9.3 44.2,25.53 43.69,26.04 42.55,26.04 41.91,25.4 C3.1 41.91,24.51 41.02,24.51 40.64,24.13 40.64,22.35 41.27,21.72 47.12,21.72 | IC7.3 44.2,15.37 43.69,15.88 42.55,15.88 41.91,15.24 C2.1 41.91,14.35 41.02,14.35 40.64,13.97 40.64,12.19 41.27,11.56 47.12,11.56 | C1.1 41.91,4.45 | IC8.3 44.2,5.33 43.81,5.71 42.55,5.71 41.91,5.08 41.91,4.45 | R14.1 v43.18,40.64 | R16.1 v45.72,40.64 46.99,40.64 48.26,39.37 48.26,33.02 | R15.1 v43.18,30.48 | R17.1 v45.72,30.48 47.12,31.88 | R34.1 v43.18,20.32 | R12.1 v45.72,20.32 47.12,21.72 | R35.1 v43.18,10.16 | R13.1 v45.72,10.16 47.12,11.56
  Top 0.254: 47.12,31.88 48.26,33.02 | 48.26,33.02 48.26,22.86 | 48.26,12.7 47.12,11.56 | 47.12,21.72 48.26,22.86 | IC18.3 95,35.81 94.61,36.2 93.34,36.2 92.71,35.56 C31.1 91.89,34.73 91.44,34.29 91.44,33.53 93.09,31.88 97.92,31.88 | IC21.3 95,25.65 94.61,26.04 93.34,26.04 92.71,25.4 C30.1 91.89,24.57 91.44,24.13 91.44,22.61 92.33,21.72 97.92,21.72 | 92.71,14.48 C29.1 91.89,14.41 | IC19.3 95,15.49 94.61,15.88 93.34,15.88 92.71,15.24 92.71,14.48 | C28.1 92.71,4.45 | IC20.3 95,5.33 94.61,5.71 93.34,5.71 92.71,5.08 92.71,4.45 | R42.1 v93.98,40.64 | R40.1 v96.52,40.64 97.79,40.64 99.06,39.37 | R43.1 v93.98,30.48 | R41.1 v96.52,30.48 97.92,31.88 | R36.1 v93.98,20.32 | R38.1 v96.52,20.32 97.92,21.72 | R37.1 v93.98,10.16 | R39.1 v96.52,10.16 97.92,11.56 | 97.92,31.88 99.06,33.02 | 97.92,21.72 99.06,22.86 | 91.89,14.41 91.44,13.97 91.44,12.57 92.46,11.56 97.92,11.56 | 92.71,4.45 92.08,4.45 91.44,3.81 91.44,2.54 92.71,1.27 | 80.01,4.45 79.38,4.45 78.74,3.81 78.74,1.91 79.38,1.27 85.09,1.27 86.36,2.54 | 86.36,2.54 86.36,12.7 | 67.31,4.45 66.67,4.45 66.04,3.81 66.04,2.54 67.31,1.27 | 73.66,2.54 73.66,12.7 | 54.61,4.45 53.98,4.45 53.34,3.81 53.34,2.54 54.61,1.27 59.69,1.27 60.96,2.54 | 60.96,2.54 60.96,12.7 | 41.91,4.45 41.27,4.45 40.64,3.81 40.64,2.54 41.91,1.27 46.99,1.27 48.26,2.54 | 48.26,2.54 48.26,12.7 | 73.66,2.54 72.39,1.27 | 48.26,22.86 48.26,12.7 | 92.71,14.48 91.95,14.48 91.89,14.41 | 97.92,11.56 99.06,12.7 | v83.82,20.32 86.36,22.86 | 86.36,22.86 86.36,12.7 | 86.36,2.54 87.63,1.27 | 53.34,22.99 54.61,21.72 59.56,21.72 59.69,21.59 | 59.82,21.72 60.96,22.86 | 60.96,22.86 60.96,12.7 | 60.96,2.54 62.23,1.27 | 73.66,2.54 74.93,1.27
  Top 0.254: 48.26,2.54 49.53,1.27 | C32.2 93.98,64.14 95.89,62.23 | C33.2 69.85,64.14 72.07,61.91 | U2.3 41.91,59.05 v42.55,58.42 | v46.35,61.59 U2.24 | U5.3 66.67,59.05 v67.31,58.42 | U3.3 90.81,59.05 v91.44,58.42
  Top 0.406: 46.99,1.27 49.53,1.27 62.23,1.27 67.31,1.27 72.39,1.27 74.93,1.27 87.63,1.27 92.71,1.27 97.79,1.27 99.06,2.54 99.06,12.7 99.06,22.86 99.06,33.02 99.06,39.37 99.06,57.78 | U4.5 29.97,75.88 C4.1 37.66,75.37 43.81,69.22 43.81,64.33 C34.2 45.41,64.14 U2.24 48.9,61.59 49.53,62.23 62.23,62.23 62.87,61.59 U5.1 64.14,61.59 64.77,62.23 v67.31,62.23 71.75,62.23 72.07,61.91 72.39,61.59 U5.24 74.3,61.59 74.93,62.23 86.36,62.23 87,61.59 U3.1 88.9,61.59 89.53,62.23 v91.44,62.23 95.89,62.23 96.52,61.59 U3.24 99.06,61.59 99.06,57.78 | U3.21 99.06,57.78
  Bottom 0.254: v81.28,40.64 v83.82,40.64 | v81.28,30.48 v83.82,30.48 | v81.28,20.32 v83.82,20.32 | v81.28,10.16 v83.82,10.16 | v68.58,40.64 v71.12,40.64 | v68.58,30.48 v71.12,30.48 | v68.58,20.32 v71.12,20.32 | v68.58,10.16 v71.12,10.16 | v55.88,40.64 v58.42,40.64 | v55.88,30.48 v58.42,30.48 | v55.88,20.32 v58.42,20.32 | v55.88,10.16 v58.42,10.16 | v43.18,40.64 v45.72,40.64 | v43.18,30.48 v45.72,30.48 | v43.18,20.32 v45.72,20.32 | v43.18,10.16 v45.72,10.16 | v93.98,40.64 v96.52,40.64 | v93.98,30.48 v96.52,30.48 | v93.98,20.32 v96.52,20.32 | v93.98,10.16 v96.52,10.16 | v42.55,58.42 43.18,58.42 v46.35,61.59 | v67.31,58.42 v67.31,62.23 | v91.44,58.42 v91.44,62.23
  pour Top (isolate 0.406): 0,0 99.69,0 99.69,81.28 0,81.28
AREF
  Top 0.254: C6.1 20.51,68.72 U1.42
AVCC
  Top 0.254: L1.1 16.95,70.23 C7.1 17.4,70.13 U1.44
D+
  Top 0.406: USB1.3 8.89,64.77 | 8.89,64.77 10.03,64.77 R4.1 | Z1.1 9.53,64.14 8.89,64.77
D-
  Top 0.406: USB1.2 8.89,65.56 | 8.89,65.56 10.19,65.56 R11.1 | Z2.1 9.53,66.19 8.89,65.56
GND  (via drill 0.5, 0.6)
  Top 0.254: C27.2 80.01,33.02 80.52,32.51 82.55,32.51 | 82.55,32.51 82.8,32.77 IC14.8 | C26.2 80.01,23.11 80.64,22.48 82.55,22.48 | 82.55,22.48 82.8,22.73 IC17.8 82.8,22.86 | C25.2 80.01,12.7 80.39,12.32 82.55,12.32 | 82.55,12.32 82.8,12.57 IC15.8 | 82.55,1.91 80.64,1.91 80.01,2.54 C24.2 | 82.55,1.91 82.8,2.16 IC16.8 | 82.55,12.32 84.71,12.32 v85.09,12.7 | 82.55,22.48 84.71,22.48 v85.09,22.86 | 82.55,32.51 84.58,32.51 v85.09,33.02 | 82.55,1.91 84.45,1.91 v85.09,2.54 | C23.2 67.31,33.27 68.07,32.51 69.85,32.51 | 70.1,32.76 70.1,32.77 IC10.8 70.1,32.76 | 70.1,32.76 69.85,32.51 | 69.85,32.51 71.88,32.51 v72.39,33.02 | C22.2 67.31,22.99 67.94,22.35 69.85,22.35 | 69.85,22.35 71.88,22.35 v72.39,22.86 | IC13.8 70.1,22.6 69.85,22.35 | C21.2 67.31,12.83 67.94,12.19 69.85,12.19 | 69.85,12.19 71.88,12.19 v72.39,12.7 | IC11.8 70.1,12.44 69.85,12.19 | C20.2 67.31,2.54 67.94,1.91 69.85,1.91 | 69.85,1.91 71.75,1.91 v72.39,2.54 | IC12.8 70.1,2.15 69.85,1.91 | C19.2 54.61,33.02 55.24,32.38 57.15,32.38 | 57.15,32.38 59.05,32.38 v59.69,33.02 | IC2.8 57.4,32.63 57.15,32.38 | C18.2 54.61,22.86 55.24,22.23 57.15,22.23 | 57.15,22.23 59.05,22.23 v59.69,22.86 | IC5.8 57.4,22.48 57.15,22.23 | C17.2 54.61,12.83 55.24,12.19 57.15,12.19 | 57.15,12.19 59.18,12.19 v59.69,12.7 | IC3.8 57.4,12.44 57.15,12.19 | C16.2 54.61,2.54 55.24,1.91 57.15,1.91 | 57.15,1.91 59.05,1.91 v59.69,2.54 | IC4.8 57.4,2.15 57.15,1.91 | C15.2 41.91,33.02 42.55,32.38 44.45,32.38 | 44.45,32.38 46.35,32.38 v46.99,33.02 | IC6.8 44.7,32.63 44.45,32.38 | C3.2 41.91,22.86 42.55,22.23 44.45,22.23 | 44.45,22.23 46.35,22.23 v46.99,22.86 | IC9.8 44.7,22.48 44.45,22.23 | C2.2 41.91,12.7 42.55,12.06 44.45,12.06
  Top 0.254: 44.45,12.06 46.35,12.06 v46.99,12.7 | IC7.8 44.7,12.31 44.45,12.06 | C1.2 41.91,2.54 42.55,1.91 44.45,1.91 | 44.45,1.91 46.35,1.91 v46.99,2.54 | IC8.8 44.7,2.15 44.45,1.91 | C28.2 92.71,2.54 93.34,1.91 95.25,1.91 | 95.25,1.91 97.16,1.91 v97.79,2.54 | IC20.8 95.5,2.15 95.25,1.91 | C29.2 92.71,12.7 93.34,12.06 95.25,12.06 | 95.25,12.06 97.16,12.06 v97.79,12.7 | IC19.8 95.5,12.31 95.25,12.06 | C30.2 92.71,22.86 93.34,22.23 95.25,22.23 | 95.25,22.23 97.16,22.23 v97.79,22.86 | IC21.8 95.5,22.48 95.25,22.23 | C31.2 92.71,33.02 93.34,32.38 95.25,32.38 | 95.25,32.38 97.16,32.38 v97.79,33.02 | IC18.8 95.5,32.63 95.25,32.38 | U5.12 63.8,47.32 v64.77,46.35 | U2.12 38.41,47.32 v39.37,46.35 | C12.1 v19.56,51.44 | C13.1 v25.53,51.44 | K1.3 K1.2 2.03,55.18 | U1.15 21.26,59.36 v21.59,59.69 22.41,58.87 U1.23 | U1.5 18.89,63.66 v19.05,63.5 | C9.2 R2.1 v13.97,75.56 15.24,75.56 16.13,76.45 ON.- | C7.2 18.8,71.56 C6.2 19.62,68.7 U1.43 19.66,67.33 20.32,66.67 v22.86,66.67 25.4,66.67 26.06,67.33 U1.35 25.97,68.75 C11.2 | C14.- v3.81,76.2 | v23.5,74.3 23.5,73.03 24.13,72.39 28.57,72.39 | 28.57,72.39 29.21,71.75 R10.1 | C4.2 30.48,74.3 28.57,72.39 | C10.2 31.11,63.5 31.75,64.14 34.8,64.14 L.- 35.18,64.26 35.31,64.14 37.72,64.14 v38.35,63.5 | U2.2 36.2,60.33 v35.56,59.69 | v38.35,63.5 38.35,61.65 U2.1 | C34.1 38.99,64.14 v38.35,63.5 | U5.2 60.96,60.33 v60.71,60.07 | U3.2 85.09,60.33 v84.84,60.07 | U3.12 87.94,47.32 v88.9,46.35 | U5.21 80.64,57.78 v81.28,57.15 | U2.21 56.52,57.78 v57.15,57.15 | C33.1 v66.67,64.14 | C32.1 v90.81,64.14
  Top 0.406: U4.2 24.13,74.93 v23.5,74.3 | USB1.5 7.24,60.96 | 7.24,60.96 7.24,60.58 USB1.GND@1 | 7.24,60.96 7.75,61.47 Z1.2 9.65,61.59 C5.2 | USB1.GND@2 K1.2 | Z2.2 7.11,68.71 USB1.GND@4
  Bottom 0.254: v19.56,51.44 19.68,51.44 | v25.53,51.44 25.4,51.44
  Bottom 0.406: Z2.2 9.53,68.58
  pour Bottom (isolate 0.406): 0,0 99.69,0 99.69,81.28 0,81.28
IO13*
  Top 0.254: 30.57,66.06 R8.1 30.64,66.06 U1.32
MISO
  Top 0.254: U1.11 15.69,58.87 15.24,58.42 15.24,50.16 14.61,49.53 12.7,49.53 J4.1
MOSI
  Top 0.254: U1.10 14.58,59.66 13.97,59.05 J4.5
N$2
  Top 0.254: U2.18 51.44,53.98 52.07,53.34 52.07,30.99 R47.2 57.02,27.18 57.4,26.8 IC5.2
N$3
  Top 0.254: R5.2 ON.+
N$5
  Top 0.254: U2.17 46.35,52.7 45.72,53.34 45.72,53.98 46.35,54.61 52.07,54.61 52.7,53.98 52.7,31.73 53.06,31.37 56.79,31.37 57.15,31.01 57.15,28.45 R45.2 58.42,25.55 IC5.1
N$6
  Top 0.254: U1.33 28.77,66.86 29.21,67.31 R10.2
N$7
  Top 0.254: R8.2 L.+
N$8
  Top 0.254: U2.6 37.47,55.24 35.56,53.34 35.56,44.45 38.1,41.91 38.1,23.75 40.64,21.21 44.07,21.21 44.45,20.83 44.45,18.29 R12.2 45.72,15.39 IC7.1
N$9
  Top 0.254: U2.7 40.01,53.98 40.64,54.61 40.64,55.24 40.01,55.88 36.83,55.88 34.92,53.98 34.92,43.81 37.47,41.27 37.47,22.73 R34.2 44.32,17.02 44.7,16.64 IC7.2
N$10
  Top 0.254: U2.4 37.47,57.78 34.29,54.61 34.29,43.18 36.83,40.64 36.83,14.86 40.64,11.05 44.07,11.05 44.45,10.67 44.45,8.13 R13.2 45.72,5.23 IC8.1
N$11
  Top 0.254: U2.5 40.01,56.52 40.64,57.15 40.64,57.78 40.01,58.42 36.83,58.42 33.66,55.24 33.66,42.55 36.2,40.01 36.2,13.84 R35.2 44.32,6.86 44.7,6.48 IC8.2
N$12
  Top 0.254: U2.15 46.35,50.16 45.72,50.8 45.72,51.53 46.26,52.07 50.66,52.07 51.56,51.17 51.56,22.48 52.83,21.21 56.77,21.21 57.15,20.83 57.15,18.29 R18.2 58.42,15.39 IC3.1
N$13
  Top 0.254: U2.13 46.35,47.62 45.72,48.26 45.72,48.99 46.26,49.53 49.28,49.53 50.16,48.64 50.16,14.22 53.34,11.05 56.77,11.05 57.15,10.67 57.15,8.13 R19.2 58.42,5.23 IC4.1
N$14
  Top 0.254: U2.14 48.9,48.9 49.53,48.26 49.53,13.21 R21.2 57.02,6.86 57.4,6.48 IC4.2
N$15
  Top 0.254: U2.16 50.16,51.44 50.8,50.8 50.8,22.1 R20.2 57.02,17.02 57.4,16.64 IC3.2
N$16
  Top 0.254: U2.8 37.47,52.7 36.83,52.07 36.83,45.72 39.37,43.18 39.37,32 40.01,31.37 44.07,31.37 44.45,30.99 44.45,28.45 R17.2 45.72,25.55 IC9.1
N$17
  Top 0.254: U2.9 40.01,51.44 40.64,52.07 40.64,52.7 40.01,53.34 36.83,53.34 36.2,52.7 36.2,45.21 38.73,42.67 38.73,31.62 R15.2 44.2,27.18 44.7,26.67 IC9.2
N$18
  Top 0.254: U2.10 40.01,50.16 41.91,48.26 41.91,43.18 44.45,40.64 44.45,38.61 R16.2 45.72,35.71 IC6.1
N$19
  Top 0.254: U2.11 40.01,48.9 40.64,48.26 40.64,39.88 R14.2 44.32,37.34 44.7,36.96 IC6.2
N$20
  Top 0.254: U2.19 46.35,55.24 45.72,55.88 45.72,56.61 46.26,57.15 54.61,57.15 57.15,54.61 57.15,38.61 R44.2 58.42,35.71 IC2.1
N$21
  Top 0.254: U2.20 53.98,56.52 54.61,55.88 54.61,38.61 R46.2 57.02,37.34 57.4,36.96 IC2.2
N$24
  Top 0.254: U5.6 61.59,55.24 60.96,54.61 60.96,46.35 63.5,43.81 63.5,23.75 66.04,21.21 69.05,21.21 69.85,20.41 69.85,18.29 R24.2 71.12,15.39 IC11.1
N$25
  Top 0.254: U5.4 61.59,57.78 59.69,55.88 59.69,45.72 62.23,43.18 62.23,15.24 66.04,11.05 69.04,11.05 69.85,10.24 69.85,8.13 R25.2 71.12,5.23 IC12.1
N$26
  Top 0.254: U5.5 65.41,56.52 66.04,57.15 66.04,57.88 65.5,58.42 61.09,58.42 59.05,56.39 59.05,45.47 61.59,42.93 61.59,13.84 R23.2 69.72,6.86 70.1,6.48 IC12.2
N$27
  Top 0.254: U5.7 65.41,53.98 66.04,54.61 66.04,55.31 65.47,55.88 60.96,55.88 60.33,55.24 60.33,46.1 62.87,43.56 62.87,22.73 R22.2 69.85,17.02 70.1,16.76 IC11.2
N$28
  Top 0.254: U5.8 62.87,52.7 62.23,52.07 62.23,46.99 64.77,44.45 64.77,32.64 66.04,31.37 69.13,31.37 69.85,30.65 69.85,28.45 R27.2 71.12,25.55 IC13.1
N$29
  Top 0.254: U5.9 65.41,51.44 66.04,52.07 66.04,52.7 65.41,53.34 62.23,53.34 61.59,52.7 61.59,46.74 64.14,44.2 64.14,31.62 R29.2 69.85,27.18 70.1,26.92 IC13.2
N$30
  Top 0.254: U5.10 66.04,50.16 67.94,48.26 67.94,43.73 69.85,41.83 69.85,38.61 R26.2 71.12,35.71 IC10.1
N$31
  Top 0.254: U5.11 66.04,48.9 66.67,48.26 66.67,39.24 R28.2 69.85,37.34 70.1,37.08 IC10.2
N$32
  Top 0.254: IC15.1 83.82,15.39 R30.2 82.55,18.29 82.55,20.57 81.79,21.34 78.74,21.34 76.83,23.24 76.83,51.56 76.33,52.07 71.75,52.07 71.12,51.44 71.12,50.8 71.75,50.16 U5.15
N$33
  Top 0.254: IC16.1 83.82,5.23 R31.2 82.55,8.13 82.55,10.44 81.81,11.18 78.74,11.18 75.56,14.35 75.56,48.9 74.93,49.53 71.75,49.53 71.12,48.9 71.12,48.26 71.75,47.62 U5.13
N$34
  Top 0.254: U5.14 74.3,48.9 74.93,48.26 74.93,13.21 R33.2 82.42,6.86 82.8,6.48 IC16.2
N$35
  Top 0.254: U5.16 75.56,51.44 76.2,50.8 76.2,22.1 R32.2 82.42,17.02 82.8,16.64 IC15.2
N$36
  Top 0.254: IC17.1 83.82,25.55 R50.2 82.55,28.45 82.55,30.86 82.04,31.5 78.74,31.5 78.11,32 78.11,53.98 77.47,54.61 71.75,54.61 71.12,53.98 71.12,53.34 71.75,52.7 U5.17
N$37
  Top 0.254: U5.18 76.83,53.98 77.47,53.34 77.47,30.99 R48.2 82.3,27.18 82.8,26.67 IC17.2
N$38
  Top 0.254: IC14.1 83.82,35.71 R51.2 82.55,38.61 82.55,41.1 81.74,41.91 80.01,41.91 79.38,42.55 79.38,56.64 79.12,56.9 78.87,57.15 71.75,57.15 71.12,56.52 71.12,55.88 71.75,55.24 U5.19
N$39
  Top 0.254: U5.20 78.11,56.52 78.74,55.88 78.74,39.88 R49.2 82.3,37.34 82.8,36.83 IC14.2
N$40
  Top 0.254: U3.6 87,55.24 85.09,53.34 85.09,45.21 88.9,41.4 88.9,23.75 91.44,21.21 95,21.21 95.25,20.95 95.25,18.29 R38.2 96.52,15.39 IC19.1
N$41
  Top 0.254: U3.4 87,57.78 83.82,54.61 83.82,44.45 87.63,40.64 87.63,14.86 91.44,11.05 95,11.05 95.25,10.79 95.25,8.13 R39.2 96.52,5.23 IC20.1
N$42
  Top 0.254: U3.5 89.53,56.52 90.17,57.15 90.17,57.78 89.53,58.42 86.36,58.42 83.19,55.24 83.19,44.2 87,40.39 87,13.84 R37.2 95.12,6.86 95.5,6.48 IC20.2
N$43
  Top 0.254: U3.7 89.53,53.98 90.17,54.61 90.17,55.24 89.53,55.88 86.36,55.88 84.45,53.98 84.45,44.83 88.27,41.02 88.27,22.73 R36.2 95.12,17.02 95.5,16.64 IC19.2
N$44
  Top 0.254: U3.8 87,52.7 86.36,52.07 86.36,45.72 90.17,41.91 90.17,33.91 92.71,31.37 95,31.37 95.25,31.11 95.25,28.45 R41.2 96.52,25.55 IC21.1
N$45
  Top 0.254: U3.9 89.53,51.44 90.17,52.07 90.17,52.7 89.53,53.34 86.36,53.34 85.72,52.7 85.72,45.47 89.53,41.66 89.53,31.62 R43.2 95.12,27.18 95.5,26.8 IC21.2
N$46
  Top 0.254: U3.10 90.81,50.16 92.71,48.26 92.71,43.18 95.25,40.64 95.25,38.61 R40.2 96.52,35.71 IC18.1
N$47
  Top 0.254: U3.11 90.81,48.9 91.44,48.26 91.44,39.88 R42.2 95,37.34 95.5,36.83 IC18.2
RD+
  Top 0.254: U1.4 13.79,64.47 R4.2
RD-
  Top 0.254: U1.3 14.24,65.27 R11.2
RESET
  Top 0.254: U1.13 19.66,55.85 18.41,54.61 18.41,52.96 J4.3 16.51,48.56 D2.+ 15.57,46.24 R1.2 14.61,44.9 14.61,44.45 13.97,43.81 6.99,43.81 6.6,44.2 K1.4
SCK
  Top 0.254: U1.9 14.11,60.47 12.7,59.05 12.7,52.07 J4.2
SCL
  Top 0.254: U1.18 23.66,55.72 24.13,55.24 29.84,55.24 | 29.84,55.24 32.38,55.24 36.83,59.69 45.09,59.69 45.72,59.05 U2.22 61.59,59.05 62.23,59.69 70.48,59.69 71.12,59.05 U5.22 85.72,59.05 86.36,59.69 94.61,59.69 95.25,59.05 U3.22 | R53.1 29.72,55.12 29.84,55.24
SDA
  Top 0.254: U1.19 24.46,56.19 24.77,55.88 30.48,55.88 34.8,60.2 | U3.23 95.25,60.33 94.61,60.96 75.56,60.96 74.93,60.33 U5.23 71.12,60.33 70.48,60.96 50.16,60.96 49.53,60.33 U2.23 45.72,60.33 45.09,60.96 35.56,60.96 34.92,60.33 34.8,60.2 | R52.1 34.8,60.2
UCAP
  Top 0.254: U1.6 13.97,62.87 12.7,61.59 C5.1
VUSB
  Top 0.254: R1.1 12.37,46.24 D2.- 10.16,47.62 8.89,48.9 8.89,52.7 9.53,53.34 J4.6 11.43,58.93 14.61,62.1 17.02,62.1 U1.7 17.1,62.1 20.32,62.1 | 10.6,75.95 10.6,77.09 R5.1 | 20.32,62.1 20.95,62.74 22.99,62.74 26.04,59.69 28.64,59.69 U1.24 29.84,59.66 | U1.14 20.46,61.96 20.32,62.1 | 20.19,65.41 25.53,65.41 26.92,66.8 26.92,68.6 U1.34 | C11.1 U1.34 | U1.34 | U4.1 26.36,75.88 26.67,75.56 26.67,74.42 26.29,74.04 25.43,74.04 U4.3 | 29.84,59.66 30.45,59.66 31.11,60.33 C10.1 32.83,61.53 R52.2 | R53.2 29.34,56.64 30.48,57.78 30.48,59.03 29.84,59.66
  Top 0.406: F1.2 10.6,75.95 R2.2 C9.1 10.99,73.03 | 10.99,73.03 10.99,70.29 15.24,66.04 17.04,66.04 | 17.04,66.04 U1.2 | 10.99,73.03 12,72.01 L1.2 18.48,75.88 U4.1 | 17.04,66.04 19.05,66.04 19.68,65.41 20.19,65.41 20.32,65.41 20.95,64.77 20.95,62.74
VUSBD
  Top 0.406: 5.71,70.48 5.71,66.93 6.35,66.29 7.19,66.29 USB1.1 | C14.+ 4.7,71.5 5.71,70.48 | F1.1 6.86,71.63 5.71,70.48
XTAL1
  Top 0.254: U1.17 22.86,54.48 C13.2 24,49.66 Y1.2
XTAL2
  Top 0.254: U1.16 22.06,54.32 C12.2 21.08,49.53 Y1.1 21.08,49.28